# EasyEDA Pro project can-mcu.eprj, schematic remote-dim-a
Board Name: remote-dim-a; Create Date: 2026-08-17; Page Name: P1; Project Name: can-mcu; Schematic Name: remote-dim-a; Update Date: 2026-08-18; Company: EasyEDA.com; Page Size: A4; Version: V1.0
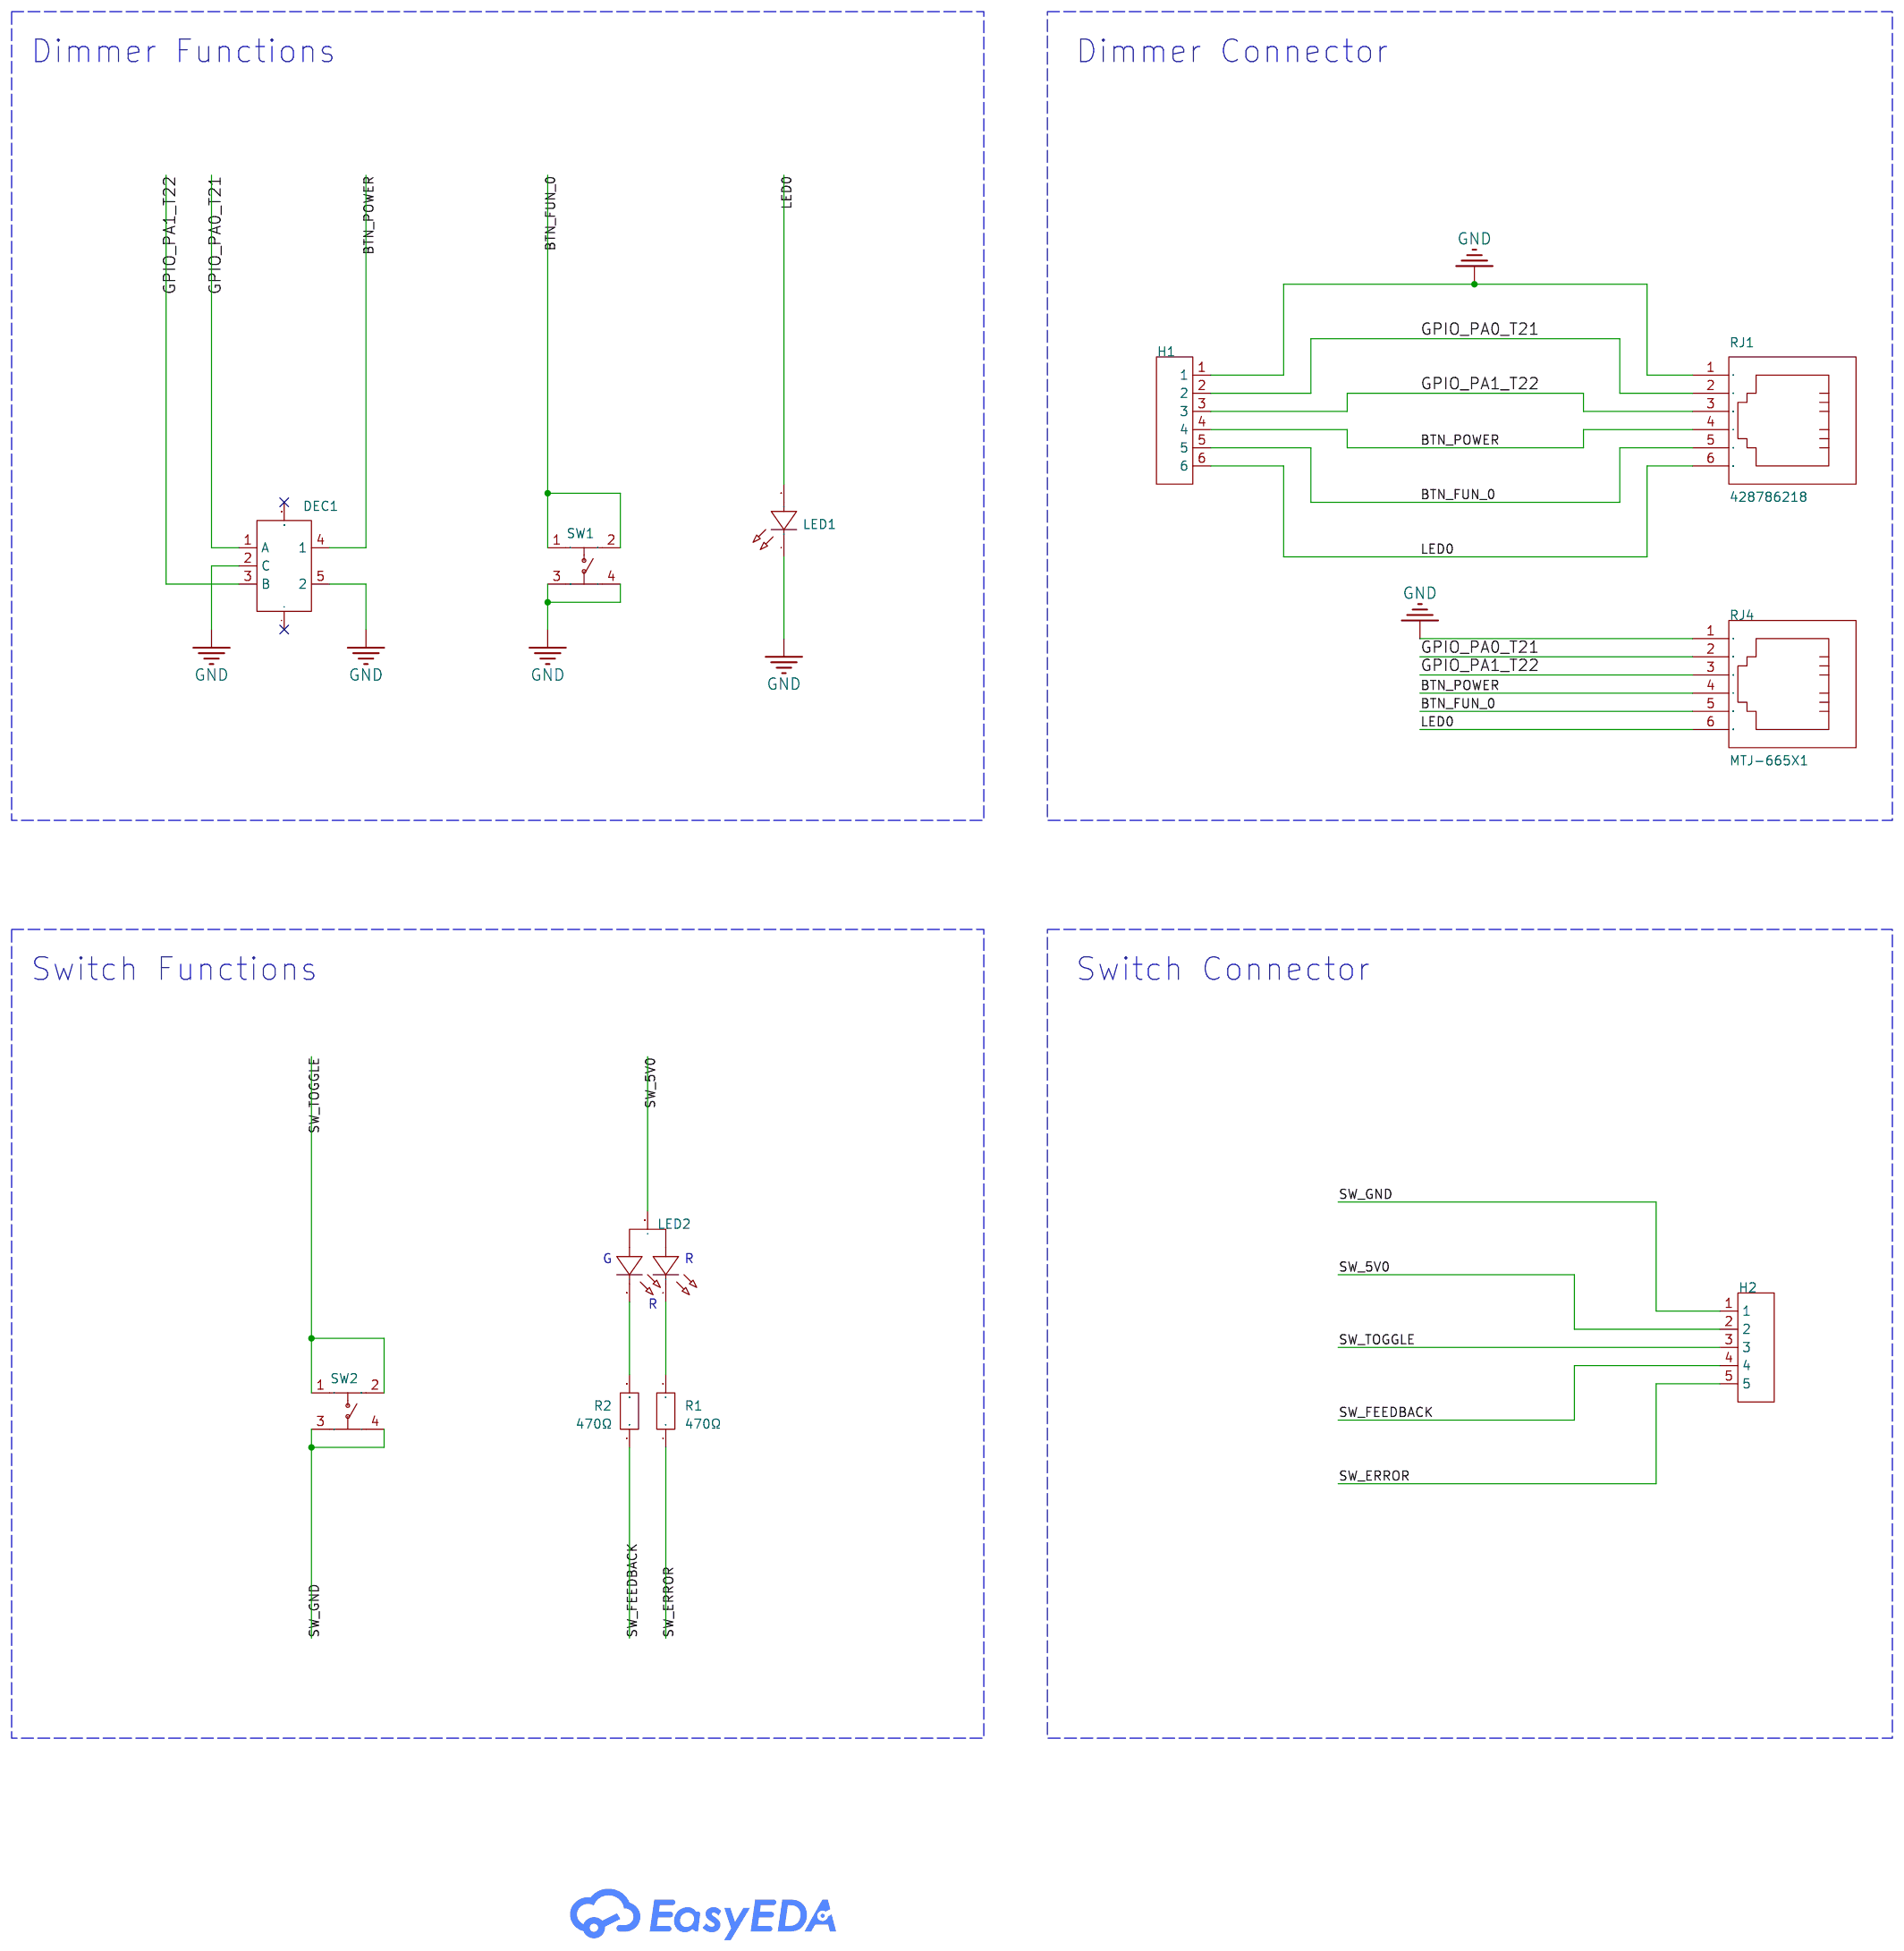
[diagram p4: schematic sheet]

## Parts
DEC1  PEC11R-4215F-S0024  [SW-TH_5P-L12.5-W13.4-P2.50-LS14.5]
H1  PZ254V-11-06P  [HDR-TH_6P-P2.54-V-M]
H2  PZ254V-11-05P  [HDR-TH_5P-P2.54-V-M]
LED1  TZ-L2-03YYBYG1GDJ30-001  [LED-TH_BD3.8-P2.54-RD]
LED2  TZ-LAMP03RG4HD-A  [LED-TH_3P-BD3.9-P2.54-R-BI]
R1  470Ω  [R1206]
R2  470Ω  [R1206]
RJ1  428786218  [RJ45-TH_428786218]
RJ4  MTJ-665X1  [RE45-TH_MTJ-665X1]
SW1  TC-6610-8-260G  [SW-TH_4P-L5.0-W5.0-P4.50-LS6.5]
SW2  TC-6610-8-260G  [SW-TH_4P-L5.0-W5.0-P4.50-LS6.5]

## Library data of the parts
DEC1 = PEC11R-4215F-S0024: LCSC Part Name: 三件套 PEC11R-4215F-S0024（三件套）; Supplier Part: C143790; Manufacturer: BOURNS; Supplier Footprint: 插件; JLCPCB Part Class: Extended Part; Datasheet: https://item.szlcsc.com/datasheet/PEC11R-4215F-S0024/155121.html; Supplier: LCSC
H1 = PZ254V-11-06P: LCSC Part Name: 1x6P 间距:2.54mm 方针 直插; Supplier Part: C492405; Manufacturer: XFCN(兴飞); Supplier Footprint: 插件,P=2.54mm; JLCPCB Part Class: Extended Part; Datasheet: https://item.szlcsc.com/datasheet/PZ254V-11-06P/502961.html; Supplier: LCSC; Pin Structure: 1x6P; Pitch: 2.54mm; Circluar Pins/Square Pins: Pin Header; Mounting Type: Through Hole; Number of Rows: 1; Number of Pins: 6P; Current Rating: 3A; Voltage Rating (Max): 250V; Length of Mating Pin: 6mm; Insulation Height: 2.5mm; Length of End Connection Pin: 3mm; Contact Material: Brass; Operating Temperature: -40℃~+105℃; Color: Black
H2 = PZ254V-11-05P: LCSC Part Name: 1x5P 间距:2.54mm 方针 直插; Supplier Part: C492404; Manufacturer: XFCN(兴飞); Supplier Footprint: 插件,P=2.54mm; Datasheet: https://item.szlcsc.com/datasheet/PZ254V-11-05P/502960.html; Supplier: LCSC; Pin Structure: 1x5P; Pitch: 2.54mm; Circluar Pins/Square Pins: Pin Header; Mounting Type: Through Hole; Number of Rows: 1; Number of Pins: 5P; Current Rating: 3A; Voltage Rating (Max): 250V; Length of Mating Pin: 6mm; Insulation Height: 2.5mm; Length of End Connection Pin: 3mm; Contact Material: Brass; Operating Temperature: -40℃~+105℃; Color: Black
LED1 = TZ-L2-03YYBYG1GDJ30-001: LCSC Part Name: 普绿/黄绿; Supplier Part: C779431; Manufacturer: TUOZHAN(拓展光电); Supplier Footprint: 插件,D=3mm; JLCPCB Part Class: Extended Part; Datasheet: https://item.szlcsc.com/datasheet/TZ-L2-03YYBYG1GDJ30-001/829092.html; Supplier: LCSC; Lamp Holder Type: 3mm Round Lens; Illumination Color: Yellow Green; Voltage - Forward(Vf): 2.5V; Power(Watts): 60mW; Forward Current: 20mA; Wavelength - Dominant: 570nm~575nm; Diode Configuration: Discrete Diode; Lens Color: Green Lens; Luminous Intensity: 120mcd; Viewing Angle: 30°; Operating Temperature: -20℃~+75℃
LED2 = TZ-LAMP03RG4HD-A: LCSC Part Name: 红灯,翠绿; Supplier Part: C779416; Manufacturer: TUOZHAN(拓展光电); Supplier Footprint: 插件,D=3mm; Datasheet: https://item.szlcsc.com/datasheet/TZ-LAMP03RG4HD-A/829077.html; Supplier: LCSC; Lamp Holder Type: 3mm Round Lens; Illumination Color: Red, Emerald Green; Voltage - Forward(Vf): 1.8V~2.4V；2.8V~3.4V; Power(Watts): 90mW；60mW; Forward Current: 20mA; Wavelength - Dominant: 515nm~520nm；620nm~625nm; Diode Configuration: Common Anode; Luminous Intensity: 50mcd；1.5cd; Viewing Angle: 30°; Operating Temperature: -40℃~+80℃
R1 R2 = FRC1206J471TS: LCSC Part Name: 470Ω ±5% 250mW 厚膜电阻; Supplier Part: C2930375; Manufacturer: FOJAN(富捷); Supplier Footprint: 1206; Supplier: LCSC; Type: Thick Film Resistor; Tolerance: ±5%; Power(Watts): 250mW; Voltage-Supply(Max): 200V; Temperature Coefficient: ±100ppm/℃; Operating Temperature: -55℃~+155℃
RJ1 = 428786218: LCSC Part Name: 直插 不带LED; Supplier Part: C505211; Manufacturer: MOLEX; Supplier Footprint: 插件; Datasheet: https://www.molex.com/content/dam/molex/molex-dot-com/products/automated/en-us/salesdrawingpdf/428/42878/428786218_sd.pdf?inline\; Supplier: LCSC; Mounting Type: Through Hole; Number of Ports: 1; LED: Non-LED; Shielding: Unshielded; Contact Material: Phosphor Bronze; Contact Plating: Gold; Operating Temperature: -40℃~+85℃
RJ4 = MTJ-665X1: LCSC Part Name: 不带LED; Supplier Part: C6685902; Manufacturer: ADAM TECH; Supplier Footprint: 插件; JLCPCB Part Class: Extended Part; Datasheet: https://atta.szlcsc.com/upload/public/pdf/source/20231023/mtj-665x1-data-sheet.pdf-04da632e217364e13f6f42d37e7634a5.pdf; Supplier: LCSC; Number of Ports: 1; LED: Without LED; Shielding: Unshielded; Contact Material: Phosphor Bronze; Contact Plating: Gold; Operating Temperature Range: -40℃~+85℃
SW1 SW2 = TC-6610-8-260G: LCSC Part Name: 6*6*8mm 立贴 轻触开关; Supplier Part: C2845255; Manufacturer: HCTL(华灿天禄); Supplier Footprint: 插件; JLCPCB Part Class: Extended Part; Supplier: LCSC; Circuit: SPST; Operating Force: 260gf; Mounting Style: Straight; Switch Length: 6mm; Switch Width: 6mm; Switch Height: 8mm; Contact Current: 50mA; Voltage Rating (DC): 12V; Insulation Resistance: 100MΩ; Mechanical Life: 10万次

## Nets
GND: DEC1.2(C) DEC1.5(2) H1.1 LED1.1(K) RJ1.1 RJ4.1 SW1.3 SW1.4
BTN_FUN_0: H1.5 RJ1.5 RJ4.5 SW1.1 SW1.2
BTN_POWER: DEC1.4(1) H1.4 RJ1.4 RJ4.4
GPIO_PA0_T21: DEC1.1(A) H1.2 RJ1.2 RJ4.2
GPIO_PA1_T22: DEC1.3(B) H1.3 RJ1.3 RJ4.3
LED0: H1.6 LED1.2(A) RJ1.6 RJ4.6
SW_5V0: H2.2 LED2.2(+)
SW_ERROR: H2.5 R1.1
SW_FEEDBACK: H2.4 R2.1
SW_GND: H2.1 SW2.3 SW2.4
SW_TOGGLE: H2.3 SW2.1 SW2.2
$1N2414: LED2.1(-) R1.2
$1N2494: LED2.3(-) R2.2

Not connected (* = marked no-connect by the designer): DEC1 7* 8*

## Notes on the sheet
- Dimmer Functions
- Dimmer Connector
- Switch Functions
- Switch Connector
- G
- R
- R
